# EasyEDA schematic SCH_esp32-8z_230302_2023-04-26.json
TITLE: Sheet_1; REV: 1.0; Date: 2022-12-07; Sheet: 1/1; Drawn By: tkdzhangyue; Company: Your Company
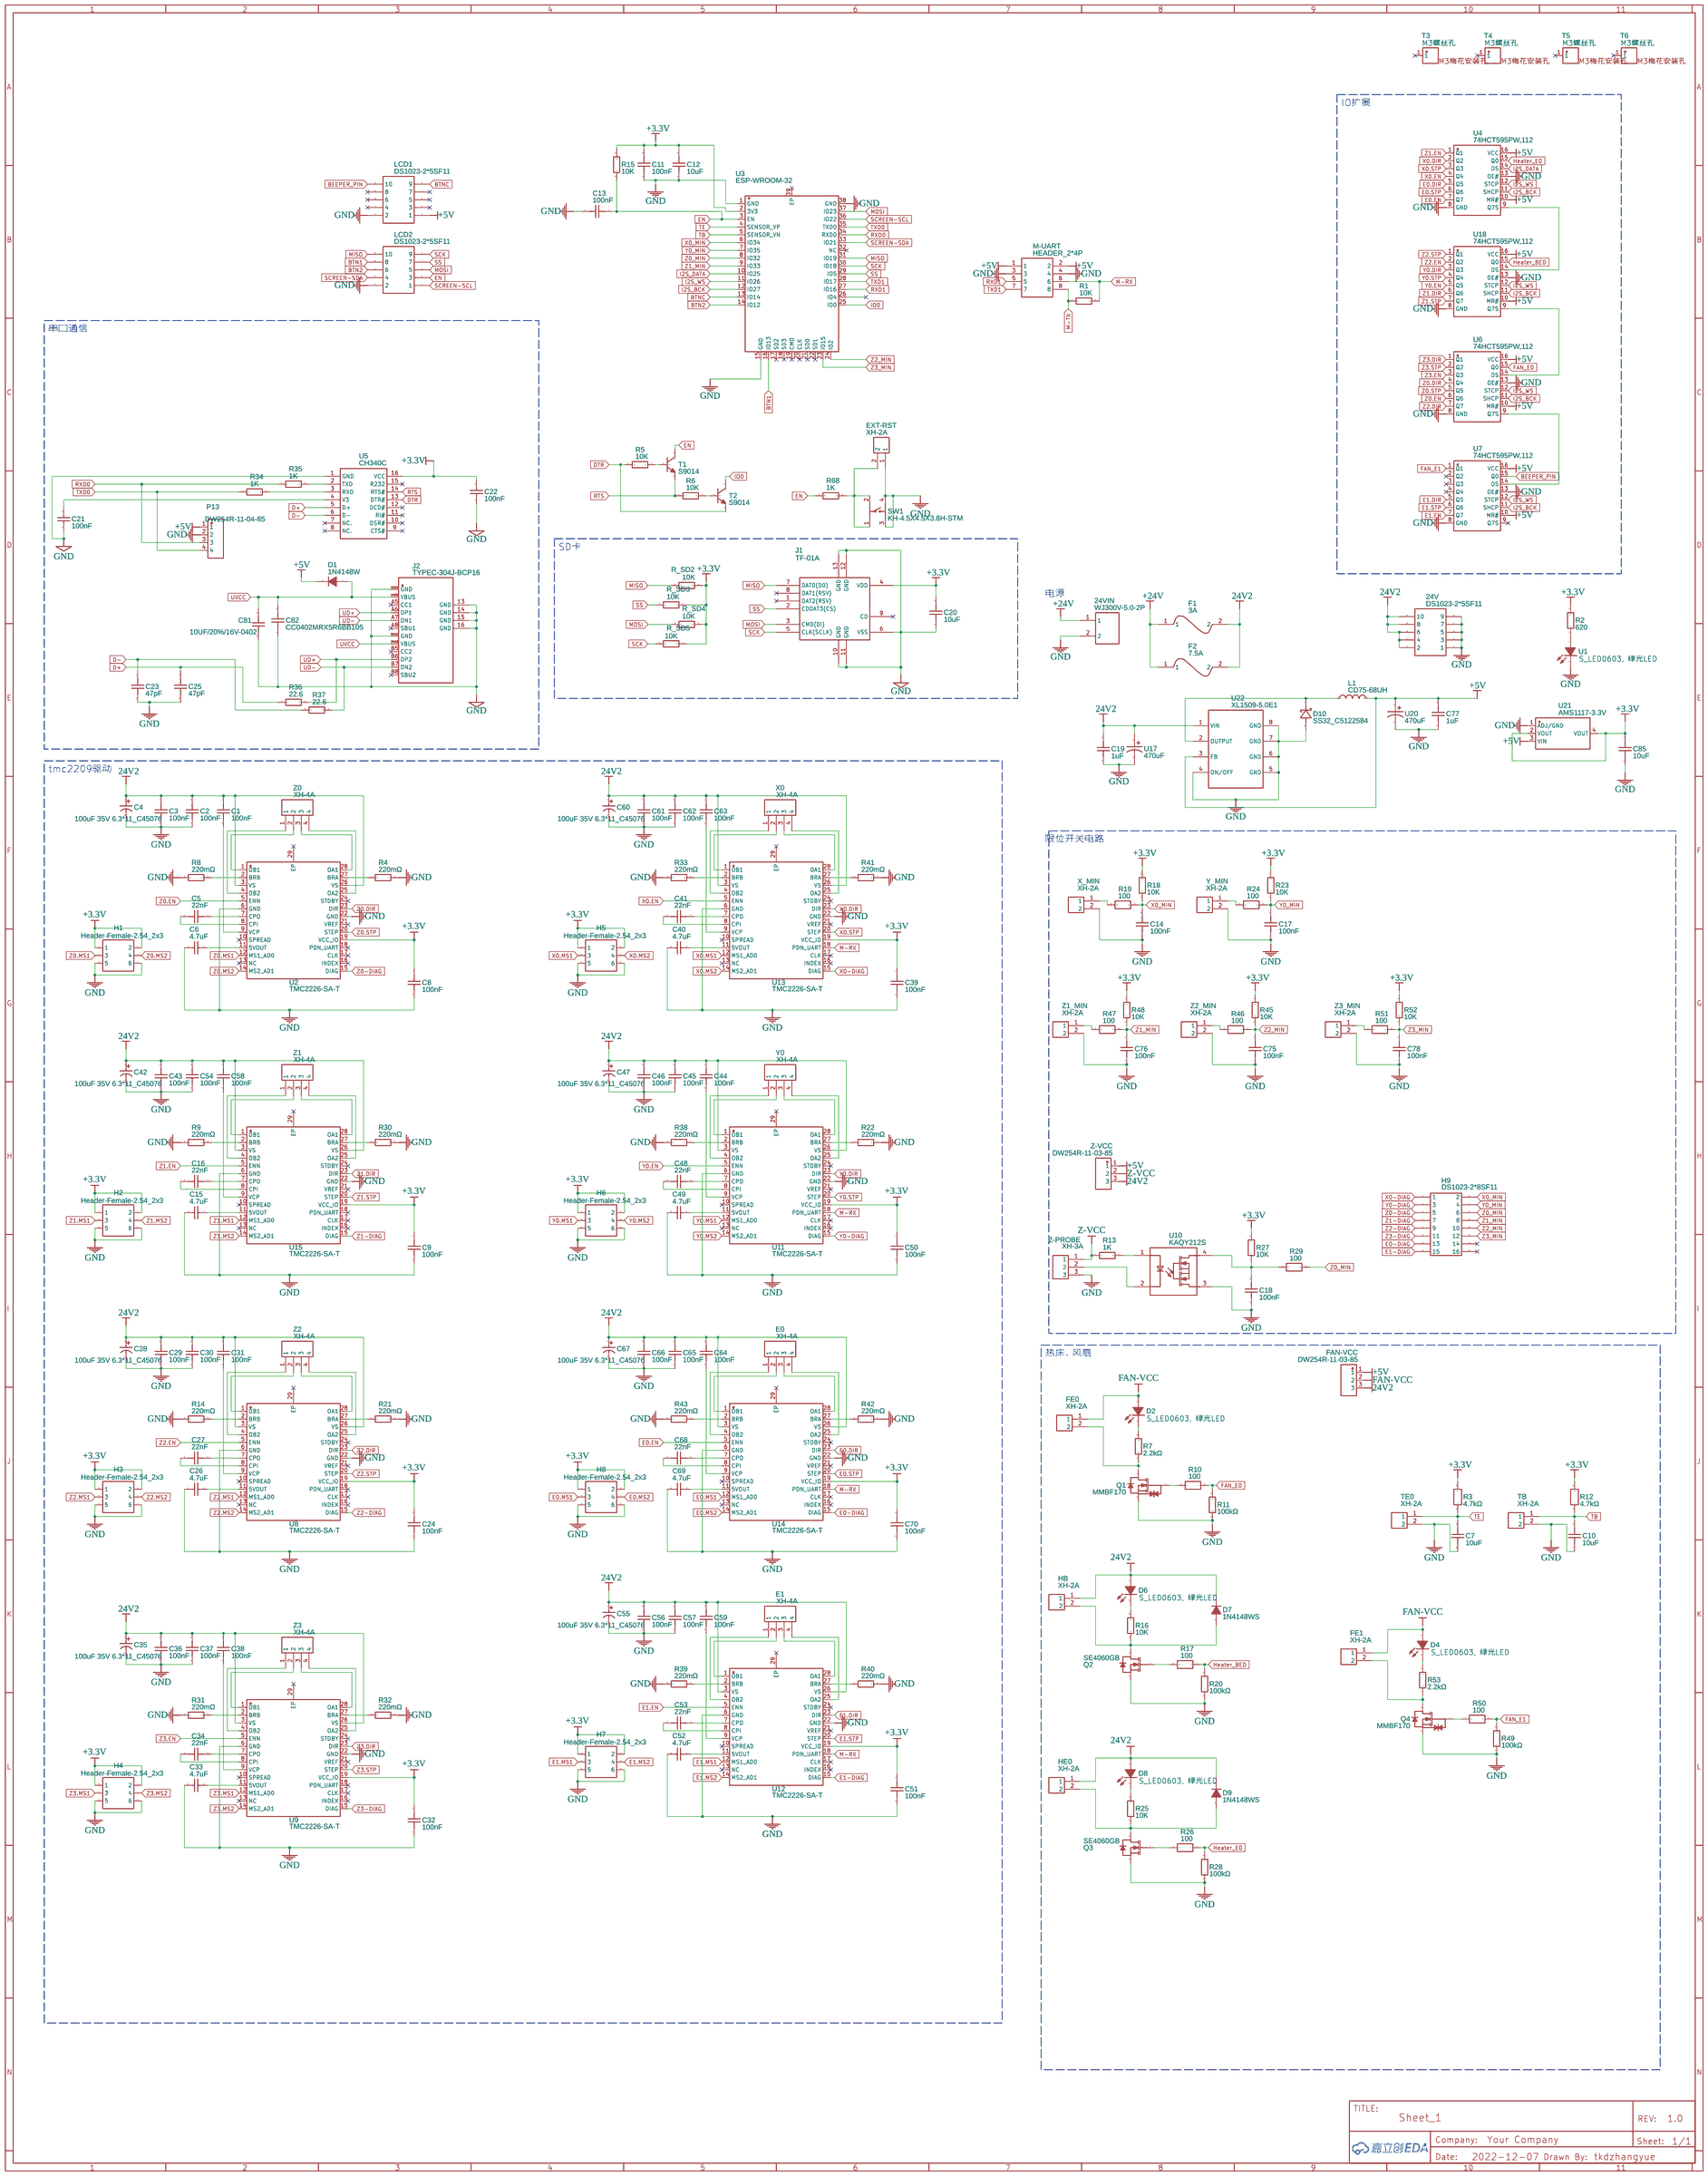
[diagram p0: schematic sheet]

## Parts
24V  DS1023-2*5SF11  [HDR-TH_10P-P2.54-V-F-R2-C5-S2.54]
24VIN  WJ300V-5.0-2P  [CONN-TH_2P-P5.00_WJ300V-5.00-2P]
C1  100nF  [C0603]
C2  100nF  [C0603]
C3  100nF  [C0603]
C4  100uF 35V 6.3*11_C45076  [CAP-TH_BD6.3-P2.50-D0.5-FD]
C5  22nF  [C0603]
C6  4.7uF  [C0603]
C7  10uF  [C0603]
C8  100nF  [C0603]
C9  100nF  [C0603]
C10  10uF  [C0603]
C11  100nF  [C0603]
C12  10uF  [C0603]
C13  100nF  [C0603]
C14  100nF  [C0603]
C15  4.7uF  [C0603]
C16  22nF  [C0603]
C17  100nF  [C0603]
C18  100nF  [C0603]
C19  1uF  [C0603]
C20  10uF  [C0603]
C21  100nF  [C0402]
C22  100nF  [C0402]
C23  47pF  [C0603]
C24  100nF  [C0603]
C25  47pF  [C0603]
C26  4.7uF  [C0603]
C27  22nF  [C0603]
C28  100uF 35V 6.3*11_C45076  [CAP-TH_BD6.3-P2.50-D0.5-FD]
C29  100nF  [C0603]
C30  100nF  [C0603]
C31  100nF  [C0603]
C32  100nF  [C0603]
C33  4.7uF  [C0603]
C34  22nF  [C0603]
C35  100uF 35V 6.3*11_C45076  [CAP-TH_BD6.3-P2.50-D0.5-FD]
C36  100nF  [C0603]
C37  100nF  [C0603]
C38  100nF  [C0603]
C39  100nF  [C0603]
C40  4.7uF  [C0603]
C41  22nF  [C0603]
C42  100uF 35V 6.3*11_C45076  [CAP-TH_BD6.3-P2.50-D0.5-FD]
C43  100nF  [C0603]
C44  100nF  [C0603]
C45  100nF  [C0603]
C46  100nF  [C0603]
C47  100uF 35V 6.3*11_C45076  [CAP-TH_BD6.3-P2.50-D0.5-FD]
C48  22nF  [C0603]
C49  4.7uF  [C0603]
C50  100nF  [C0603]
C51  100nF  [C0603]
C52  4.7uF  [C0603]
C53  22nF  [C0603]
C54  100nF  [C0603]
C55  100uF 35V 6.3*11_C45076  [CAP-TH_BD6.3-P2.50-D0.5-FD]
C56  100nF  [C0603]
C57  100nF  [C0603]
C58  100nF  [C0603]
C59  100nF  [C0603]
C60  100uF 35V 6.3*11_C45076  [CAP-TH_BD6.3-P2.50-D0.5-FD]
C61  100nF  [C0603]
C62  100nF  [C0603]
C63  100nF  [C0603]
C64  100nF  [C0603]
C65  100nF  [C0603]
C66  100nF  [C0603]
C67  100uF 35V 6.3*11_C45076  [CAP-TH_BD6.3-P2.50-D0.5-FD]
C68  22nF  [C0603]
C69  4.7uF  [C0603]
C70  100nF  [C0603]
C75  100nF  [C0603]
C76  100nF  [C0603]
C77  1uF  [C0603]
C78  100nF  [C0603]
C81  10UF/20%/16V-0402  [C0402]
C82  CC0402MRX5R6BB105  [C0402]
C85  10uF  [C0603]
D1  1N4148W  [SOD-123_L2.8-W1.8-LS3.7-RD]
D2  S_LED0603, 绿光LED  [LED0603-R-RD_GREEN]
D4  S_LED0603, 绿光LED  [LED0603-R-RD_GREEN]
D6  S_LED0603, 绿光LED  [LED0603-R-RD_GREEN]
D7  1N4148WS  [SOD-323_L1.8-W1.3-LS2.5-RD]
D8  S_LED0603, 绿光LED  [LED0603-R-RD_GREEN]
D9  1N4148WS  [SOD-323_L1.8-W1.3-LS2.5-RD]
D10  SS32_C5122584  [SMA_L4.3-W2.6-LS5.1-RD]
E0  XH-4A  [CONN-TH_4P-P2.50_XH-4A]
E1  XH-4A  [CONN-TH_4P-P2.50_XH-4A]
EXT-RST  XH-2A  [CONN-TH_XH-2A]
F1  3A  [小型汽车插片保险丝座]
F2  7.5A  [小型汽车插片保险丝座]
FAN-VCC  DW254R-11-03-85  [HDR-TH_3P-P2.54-V-F]
FE0  XH-2A  [CONN-TH_XH-2A]
FE1  XH-2A  [CONN-TH_XH-2A]
H1  Header-Female-2.54_2x3  [HDR-TH_6P-P2.54-V-F-R2-C3-S2.54]
H2  Header-Female-2.54_2x3  [HDR-TH_6P-P2.54-V-F-R2-C3-S2.54]
H3  Header-Female-2.54_2x3  [HDR-TH_6P-P2.54-V-F-R2-C3-S2.54]
H4  Header-Female-2.54_2x3  [HDR-TH_6P-P2.54-V-F-R2-C3-S2.54]
H5  Header-Female-2.54_2x3  [HDR-TH_6P-P2.54-V-F-R2-C3-S2.54]
H6  Header-Female-2.54_2x3  [HDR-TH_6P-P2.54-V-F-R2-C3-S2.54]
H7  Header-Female-2.54_2x3  [HDR-TH_6P-P2.54-V-F-R2-C3-S2.54]
H8  Header-Female-2.54_2x3  [HDR-TH_6P-P2.54-V-F-R2-C3-S2.54]
H9  DS1023-2*8SF11  [HDR-TH_16P-P2.54-V-F-R2-C8-S2.54]
HB  XH-2A  [CONN-TH_XH-2A]
HE0  XH-2A  [CONN-TH_XH-2A]
J1  TF-01A  [TF-SMD_TF-01A]
J2  TYPEC-304J-BCP16  [USB-C-SMD_TYPEC-304J-BCP16]
L1  CD75-68UH  [IND-SMD_L7.8-W7.0_APC07A50]
LCD1  DS1023-2*5SF11  [HDR-TH_10P-P2.54-V-F-R2-C5-S2.54]
LCD2  DS1023-2*5SF11  [HDR-TH_10P-P2.54-V-F-R2-C5-S2.54]
M-UART  HEADER_2*4P  [HDR-TH_8P-P2.54-V-M-R2-C4-S2.54]
P13  DW254R-11-04-85  [HDR-TH_4P-P2.54-V-F]
Q1  MMBF170  [SOT-23-3_L2.9-W1.6-P1.90-LS2.8-BR]
Q2  SE4060GB  [TO-252-2_L6.6-W6.1-P4.57-LS9.9-BR-CW]
Q3  SE4060GB  [TO-252-2_L6.6-W6.1-P4.57-LS9.9-BR-CW]
Q4  MMBF170  [SOT-23-3_L2.9-W1.6-P1.90-LS2.8-BR]
R1  10K  [R0603]
R2  620  [R0603]
R3  4.7kΩ  [R0603]
R4  220mΩ  [R0603]
R5  10K  [R0603]
R6  10K  [R0603]
R7  2.2kΩ  [R0603]
R8  220mΩ  [R0603]
R9  220mΩ  [R0603]
R10  100  [R0603]
R11  100kΩ  [R0603]
R12  4.7kΩ  [R0603]
R13  1K  [R0603]
R14  220mΩ  [R0603]
R15  10K  [R0603]
R16  10K  [R0603]
R17  100  [R0603]
R18  10K  [R0603]
R19  100  [R0603]
R20  100kΩ  [R0603]
R21  220mΩ  [R0603]
R22  220mΩ  [R0603]
R23  10K  [R0603]
R24  100  [R0603]
R25  10K  [R0603]
R26  100  [R0603]
R27  10K  [R0603]
R28  100kΩ  [R0603]
R29  100  [R0603]
R30  220mΩ  [R0603]
R31  220mΩ  [R0603]
R32  220mΩ  [R0603]
R33  220mΩ  [R0603]
R34  1K  [R0603]
R35  1K  [R0603]
R36  22.6  [R0603]
R37  22.6  [R0603]
R38  220mΩ  [R0603]
R39  220mΩ  [R0603]
R40  220mΩ  [R0603]
R41  220mΩ  [R0603]
R42  220mΩ  [R0603]
R43  220mΩ  [R0603]
R45  10K  [R0603]
R46  100  [R0603]
R47  100  [R0603]
R48  10K  [R0603]
R49  100kΩ  [R0603]
R50  100  [R0603]
R51  100  [R0603]
R52  10K  [R0603]
R53  2.2kΩ  [R0603]
R68  1K  [R0603]
R_SD2  10K  [R0603]
R_SD3  10K  [R0603]
R_SD4  10K  [R0603]
R_SD5  10K  [R0603]
SW1  KH-4.5X4.5X3.8H-STM  [SW-SMD_4P-L4.5-W4.5-P3.00-LS6.8]
T1  S9014  [SOT-23-3_L2.9-W1.6-P1.90-LS2.8-BR]
T2  S9014  [SOT-23-3_L2.9-W1.6-P1.90-LS2.8-BR]
T3  M3螺丝孔  [螺钉孔]
T4  M3螺丝孔  [螺钉孔]
T5  M3螺丝孔  [螺钉孔]
T6  M3螺丝孔  [螺钉孔]
TB  XH-2A  [CONN-TH_XH-2A]
TE0  XH-2A  [CONN-TH_XH-2A]
U1  S_LED0603, 绿光LED  [LED0603-R-RD_GREEN]
U2  TMC2226-SA-T  [HTSSOP-28_L9.8-W4.5-P0.65-LS6.6-BL-EP]
U3  ESP-WROOM-32  [WIFIM-SMD_ESP-WROOM-32]
U4  74HCT595PW,112  [TSSOP-16_L5.0-W4.4-P0.65-LS6.4-BL]
U5  CH340C  [SOP-16_L10.0-W3.9-P1.27-LS6.0-BL]
U6  74HCT595PW,112  [TSSOP-16_L5.0-W4.4-P0.65-LS6.4-BL]
U7  74HCT595PW,112  [TSSOP-16_L5.0-W4.4-P0.65-LS6.4-BL]
U8  TMC2226-SA-T  [HTSSOP-28_L9.8-W4.5-P0.65-LS6.6-BL-EP]
U9  TMC2226-SA-T  [HTSSOP-28_L9.8-W4.5-P0.65-LS6.6-BL-EP]
U10  KAQY212S  [SOP-4_L4.4-W4.0-P2.54-LS7.0-BL]
U11  TMC2226-SA-T  [HTSSOP-28_L9.8-W4.5-P0.65-LS6.6-BL-EP]
U12  TMC2226-SA-T  [HTSSOP-28_L9.8-W4.5-P0.65-LS6.6-BL-EP]
U13  TMC2226-SA-T  [HTSSOP-28_L9.8-W4.5-P0.65-LS6.6-BL-EP]
U14  TMC2226-SA-T  [HTSSOP-28_L9.8-W4.5-P0.65-LS6.6-BL-EP]
U15  TMC2226-SA-T  [HTSSOP-28_L9.8-W4.5-P0.65-LS6.6-BL-EP]
U17  470uF  [CAP-TH_BD8.0-P3.50-D0.5-FD]
U18  74HCT595PW,112  [TSSOP-16_L5.0-W4.4-P0.65-LS6.4-BL]
U20  470uF  [CAP-TH_BD8.0-P3.50-D0.5-FD]
U21  AMS1117-3.3V  [SOT-223-4_L6.5-W3.5-P2.30-LS7.0-BR]
U22  XL1509-5.0E1  [SOIC-8_L5.0-W4.0-P1.27-LS6.0-BL]
X0  XH-4A  [CONN-TH_4P-P2.50_XH-4A]
X_MIN  XH-2A  [CONN-TH_XH-2A]
Y0  XH-4A  [CONN-TH_4P-P2.50_XH-4A]
Y_MIN  XH-2A  [CONN-TH_XH-2A]
Z0  XH-4A  [CONN-TH_4P-P2.50_XH-4A]
Z1  XH-4A  [CONN-TH_4P-P2.50_XH-4A]
Z1_MIN  XH-2A  [CONN-TH_XH-2A]
Z2  XH-4A  [CONN-TH_4P-P2.50_XH-4A]
Z2_MIN  XH-2A  [CONN-TH_XH-2A]
Z3  XH-4A  [CONN-TH_4P-P2.50_XH-4A]
Z3_MIN  XH-2A  [CONN-TH_XH-2A]
Z-PROBE  XH-3A  [CONN-TH_XH-3A]
Z-VCC  DW254R-11-03-85  [HDR-TH_3P-P2.54-V-F]

## Library data of the parts
24V LCD1 LCD2 = DS1023-2*5SF11: Supplier: LCSC; Manufacturer: CONNFLY; Contributor: LCSC; Supplier Part: C92270; JLCPCB Part Class: Extended Part
24VIN = WJ300V-5.0-2P: Supplier: LCSC; Manufacturer: KANGNEX(康奈克斯电气); Supplier Part: C8385; JLCPCB Part Class: Extended Part
C1-C3 C8 C9 C11 C13 C14 C17 C18 C24 C29-C32 C36-C39 C43-C46 C50 C51 C54 C56-C59 C61-C66 C70 C75 C76 C78 = 06031C104KAT2A: Supplier: LCSC; Supplier Part: C2167300; Manufacturer: Kyocera AVX; JLCPCB Part Class: Extended Part; Contributor: LCSC
C4 C28 C35 C42 C47 C55 C60 C67 = 100uF 35V 6.3*11_C45076: Supplier Part: C45076; Supplier: LCSC; Manufacturer: ValuePro; Manufacturer Part: 100uF 35V 6.3*11; JLCPCB Part Class: Extended Part
C5 C16 C27 C34 C41 C48 C53 C68 = CC0603JRX7R7BB223: Supplier: LCSC; Supplier Part: C519532; Manufacturer: YAGEO(国巨); Contributor: LCSC; JLCPCB Part Class: Extended Part
C6 C15 C26 C33 C40 C49 C52 C69 = CC0603KRX5R6BB475: Supplier: LCSC; Manufacturer: YAGEO(国巨); Supplier Part: C109456; JLCPCB Part Class: Extended Part
C7 C10 = 10UF: Supplier: LCSC; Supplier Part: C15415; Manufacturer: SAMSUNG(三星); Contributor: LCSC; JLCPCB Part Class: Extended Part
C12 C20 C85 = TCC0603X5R106K100CT: Supplier: LCSC; Supplier Part: C380314; Manufacturer: CCTC(三环); Contributor: LCSC; JLCPCB Part Class: Extended Part
C19 C77 = 0603B105K500NT: Supplier: LCSC; Manufacturer: FH(风华); Supplier Part: C90540; JLCPCB Part Class: Extended Part
C21 C22 = 0402YD104KAT2A: Supplier: LCSC; Manufacturer: AVX; Contributor: LCSC; Supplier Part: C142647
C23 C25 = 0603N470F101: Supplier: LCSC; Manufacturer: Walsin(华新科); Contributor: LCSC; Supplier Part: C152905; JLCPCB Part Class: Extended Part
C81 = 10UF/20%/16V-0402: Supplier: LCSC; Supplier Part: C9900005775; Manufacturer Part: 10uF/20%/16V-0402; JLCPCB Part Class: Extended Part; Contributor: LCSC
C82 = CC0402MRX5R6BB105: Supplier: LCSC; Supplier Part: C113791; Manufacturer: YAGEO(国巨); Capacitance: 1uF; JLCPCB Part Class: Extended Part; Contributor: LCSC
D1 = 1N4148W: Supplier: LCSC; Manufacturer: HT; Contributor: LCSC; Supplier Part: C179717; JLCPCB Part Class: Extended Part
D2 D4 D6 D8 U1 = S_LED0603, 绿光LED: Supplier: LCSC; Supplier Part: C9900025458; Manufacturer: null; link: https://atta.szlcsc.comnull; JLCPCB Part Class: Extended Part; Contributor: lcsc
D7 D9 = 1N4148WS: Supplier: LCSC; Manufacturer: HT(金誉); Contributor: LCSC; Supplier Part: C179718; JLCPCB Part Class: Extended Part
D10 = SS32_C5122584: Supplier: LCSC; Supplier Part: C5122584; Manufacturer: Slkor(萨科微); Manufacturer Part: SS32; JLCPCB Part Class: Extended Part; Contributor: lcsc
E0 E1 X0 Y0 Z0-Z3 = XH-4A: Supplier: LCSC; Manufacturer: BOOMELE; Supplier Part: C37815; JLCPCB Part Class: Extended Part
EXT-RST FE0 FE1 HB HE0 TB TE0 X_MIN Y_MIN Z1_MIN Z2_MIN Z3_MIN = XH-2A: Supplier: LCSC; Manufacturer: BOOMELE; Supplier Part: C20079; JLCPCB Part Class: Extended Part
F1 F2 = 小型汽车插片保险座: Contributor: tkdzhangyue
FAN-VCC Z-VCC = DW254R-11-03-85: Supplier: LCSC; Supplier Part: C2935897; Manufacturer: DEALON(德艺隆); Contributor: LCSC; JLCPCB Part Class: Extended Part
H1-H8 = Header-Female-2.54_2x3: Supplier: LCSC; Manufacturer: CONNFLY; Manufacturer Part: DS1023-2*3SF11; Contributor: LCSC; Supplier Part: C92272; JLCPCB Part Class: Extended Part
H9 = DS1023-2*8SF11: Supplier: LCSC; Manufacturer: CONNFLY; Contributor: LCSC; Supplier Part: C92267; JLCPCB Part Class: Extended Part
J1 = TF-01A: Supplier: LCSC; Manufacturer: HRO; Supplier Part: C91145; JLCPCB Part Class: Extended Part
J2 = TYPEC-304J-BCP16: Supplier: LCSC; Supplier Part: C2835315; Manufacturer: XUNPU(讯普); Contributor: LCSC; JLCPCB Part Class: Extended Part
L1 = CD75-68UH: Supplier: LCSC; Supplier Part: C2836693; Manufacturer: null; Contributor: LCSC; JLCPCB Part Class: Extended Part
M-UART = HEADER_2*4P: Supplier: LCSC; Supplier Part: C9900003187; Manufacturer: null; JLCPCB Part Class: Extended Part; Contributor: LCSC
P13 = DW254R-11-04-85: Supplier: LCSC; Supplier Part: C2935898; Manufacturer: DEALON(德艺隆); Contributor: LCSC; JLCPCB Part Class: Extended Part
Q1 Q4 = MMBF170: Supplier: LCSC; Manufacturer: SHIKUES(时科); Supplier Part: C130879; JLCPCB Part Class: Extended Part
Q2 Q3 = SE4060GB: Supplier: LCSC; Supplier Part: C238624; Manufacturer: SINO-IC(光宇睿芯); Contributor: LCSC; JLCPCB Part Class: Extended Part
R1 R5 R6 R15 R16 R18 R23 R25 R27 R45 R48 R52 R_SD2-R_SD5 = AF0603JR-0710KL: Supplier: LCSC; Manufacturer: YAGEO(国巨); Supplier Part: C144116; JLCPCB Part Class: Extended Part; Resistance: 10kΩ
R2 = RC0603JR-07620RL: Supplier: LCSC; Manufacturer: YAGEO(国巨); Supplier Part: C137616; JLCPCB Part Class: Extended Part; Resistance: 620Ω
R3 R12 = RT0603FRE074K7L: Supplier: LCSC; Supplier Part: C700513; Manufacturer: YAGEO(国巨); Contributor: LCSC; JLCPCB Part Class: Extended Part
R4 R8 R9 R14 R21 R22 R30-R33 R38-R43 = CR0603F0R22P05: Supplier: LCSC; Supplier Part: C175648; Manufacturer: EVER OHMS(天二科技); Manufacturer Part: CR0603FR220P05Z; Resistance (Ohms): 0.22; Contributor: LCSC; JLCPCB Part Class: Extended Part
R7 R53 = RMC06032.2K1%N: Supplier: LCSC; Supplier Part: C325591; Manufacturer: Tyohm(幸亚电阻); Resistance (Ohms): 2.2K; Contributor: LCSC; JLCPCB Part Class: Extended Part
R10 R17 R19 R24 R26 R29 R46 R47 R50 R51 = AC0603DR-07100RL: Supplier: LCSC; Supplier Part: C227435; Manufacturer: YAGEO(国巨); Contributor: LCSC; JLCPCB Part Class: Extended Part; Resistance: 100Ω
R11 R20 R28 R49 = RMCF0603FT100K: Supplier: LCSC; Supplier Part: C237792; Manufacturer: SEI(Stackpole Electronics Inc.); Resistance (Ohms): 100K; Contributor: LCSC; JLCPCB Part Class: Extended Part
R13 R68 = RT0603FRD071KL: Supplier: LCSC; Manufacturer: YAGEO(国巨); Contributor: LCSC; Supplier Part: C136938; JLCPCB Part Class: Extended Part; Resistance: 1kΩ
R34 R35 = RC0603JR-071KL: Supplier: LCSC; Manufacturer: YAGEO(国巨); Supplier Part: C14676; JLCPCB Part Class: Extended Part; Resistance: 1kΩ
R36 R37 = AC0603FR-0722R6L: Supplier: LCSC; Supplier Part: C227718; Manufacturer: YAGEO(国巨); Contributor: LCSC; JLCPCB Part Class: Extended Part; Resistance: 22.6Ω
SW1 = KH-4.5X4.5X3.8H-STM: Supplier: LCSC; Supplier Part: C2837549; Manufacturer: kinghelm(金航标); Contributor: LCSC; JLCPCB Part Class: Extended Part
T1 T2 = S9014: Supplier: LCSC; Manufacturer: Hottech(合科泰); Contributor: LCSC; Supplier Part: C181164; JLCPCB Part Class: Extended Part
T3-T6 = M3螺丝孔: Contributor: wowlkh
U2 U8 U9 U11-U15 = TMC2226-SA-T: Supplier: LCSC; Supplier Part: C705366; Manufacturer: TRINAMIC; Contributor: LCSC; JLCPCB Part Class: Extended Part
U3 = ESP-WROOM-32: Supplier: LCSC; Manufacturer: ESPRESSIF; Supplier Part: C95209; JLCPCB Part Class: Extended Part
U4 U6 U7 U18 = 74HCT595PW,112: Supplier: LCSC; Supplier Part: C547810; Manufacturer: Nexperia(安世); Contributor: LCSC; JLCPCB Part Class: Extended Part
U5 = CH340C: Supplier: LCSC; Manufacturer: WCH; Supplier Part: C84681; JLCPCB Part Class: Extended Part
U10 = KAQY212S: Supplier: LCSC; Supplier Part: C194898; Manufacturer: Cosmo Electronics; Contributor: LCSC; JLCPCB Part Class: Extended Part
U17 U20 = 25V470UF CD110: Supplier: LCSC; Supplier Part: C2960234; Manufacturer: HRK(鸿瑞凯电子); Manufacturer Part: 25V470uF CD110; link: https://atta.szlcsc.com/upload/public/pdf/source/20220224/123D914837BFA78A3349BA812F212800.pdf; Contributor: lcsc
U21 = AMS1117-3.3V: Supplier: LCSC; Supplier Part: C2688239; Manufacturer: WPMtek(维攀微); Contributor: LCSC; JLCPCB Part Class: Extended Part
U22 = XL1509-5.0E1: Supplier: LCSC; Manufacturer: XLSEMI(芯龙); Supplier Part: C61063; JLCPCB Part Class: Basic Part
Z-PROBE = XH-3A: Supplier: LCSC; Manufacturer: BOOMELE(博穆精密); Supplier Part: C2316; JLCPCB Part Class: Extended Part

## Nets
24V2: 24V.2 24V.4 24V.6 24V.8 24V.10 C1.1 C2.2 C3.2 C4.1 C19.2 C28.1 C29.2 C30.2 C31.1 C35.1 C36.2 C37.2 C38.1 C42.1 C43.2 C44.1 C45.2 C46.2 C47.1 C54.2 C55.1 C56.2 C57.2 C58.1 C59.1 C60.1 C61.2 C62.2 C63.1 C64.1 C65.2 C66.2 C67.1 D6.1(+) D7.1(K) D8.1(+) D9.1(K) F1.2 F2.2 FAN-VCC.3 HB.1 HE0.1 U2.3(VS) U2.26(VS) U8.3(VS) U8.26(VS) U9.3(VS) U9.26(VS) U11.3(VS) U11.26(VS) U12.3(VS) U12.26(VS) U13.3(VS) U13.26(VS) U14.3(VS) U14.26(VS) U15.3(VS) U15.26(VS) U17.1 U22.1(VIN) Z-VCC.3
+3.3V: C8.1 C9.1 C11.2 C12.2 C20.2 C22.2 C24.1 C32.1 C39.1 C50.1 C51.1 C70.1 C85.2 H1.1 H1.2 H2.1 H2.2 H3.1 H3.2 H4.1 H4.2 H5.1 H5.2 H6.1 H6.2 H7.1 H7.2 H8.1 H8.2 J1.4(VDD) R2.2 R3.2 R12.2 R15.2 R18.1 R23.1 R27.2 R45.1 R48.1 R52.1 R_SD2.1 R_SD3.1 R_SD4.1 R_SD5.1 U2.19(VCC_IO) U3.2(3V3) U5.16(VCC) U8.19(VCC_IO) U9.19(VCC_IO) U11.19(VCC_IO) U12.19(VCC_IO) U13.19(VCC_IO) U14.19(VCC_IO) U15.19(VCC_IO) U21.2(VOUT) U21.4(VOUT)
+5V: C77.2 D1.1(K) FAN-VCC.1 L1.2 LCD1.1 M-UART.1 M-UART.2 P13.1 U4.10(MR#) U4.16(VCC) U6.10(MR#) U6.16(VCC) U7.10(MR#) U7.16(VCC) U18.10(MR#) U18.16(VCC) U20.1 U21.3(VIN) U22.3(FB) Z-VCC.1
+24V: 24VIN.1 F1.1 F2.1
GND: 24V.1 24V.3 24V.5 24V.7 24V.9 24VIN.2 C2.1 C3.1 C4.2 C6.2 C7.1 C8.2 C9.2 C10.1 C11.1 C12.1 C13.2 C14.1 C15.2 C17.1 C18.1 C19.1 C20.1 C21.1 C22.1 C23.2 C24.2 C25.2 C26.2 C28.2 C29.1 C30.1 C32.2 C33.2 C35.2 C36.1 C37.1 C39.2 C40.2 C42.2 C43.1 C45.1 C46.1 C47.2 C49.2 C50.2 C51.2 C52.2 C54.1 C55.2 C56.1 C57.1 C60.2 C61.1 C62.1 C65.1 C66.1 C67.2 C69.2 C70.2 C75.1 C76.1 C77.1 C78.1 C81.2 C82.2 C85.1 D10.2 EXT-RST.1 H1.5 H1.6 H2.5 H2.6 H3.5 H3.6 H4.5 H4.6 H5.5 H5.6 H6.5 H6.6 H7.5 H7.6 H8.5 H8.6 J1.6(VSS) J1.10(GND) J1.11(GND) J1.12(GND) J1.13(GND) J2.13(GND) J2.14(GND) J2.15(GND) J2.16(GND) J2.A1B12(GND) J2.B1A12(GND) LCD1.2 LCD2.2 M-UART.3 M-UART.4 P13.2 Q1.2(S) Q2.3(S) Q3.3(S) Q4.2(S) R4.1 R8.2 R9.2 R11.1 R14.2 R20.1 R21.1 R22.1 R28.1 R30.1 R31.2 R32.1 R33.2 R38.2 R39.2 R40.1 R41.1 R42.1 R43.2 R49.1 SW1.3 SW1.4 TB.2 TE0.2 U1.2(-) U2.6(GND) U2.22(GND) U3.1(GND) U3.15(GND) U3.38(GND) U4.8(GND) U4.13(OE#) U5.1(GND) U6.8(GND) U6.13(OE#) U7.8(GND) U7.13(OE#) U8.6(GND) U8.22(GND) U9.6(GND) U9.22(GND) U10.3 U11.6(GND) U11.22(GND) U12.6(GND) U12.22(GND) U13.6(GND) U13.22(GND) U14.6(GND) U14.22(GND) U15.6(GND) U15.22(GND) U17.2 U18.8(GND) U18.13(OE#) U20.2 U21.1(ADJ/GND) U22.4(ON/OFF) U22.5(GND) U22.6(GND) U22.7(GND) U22.8(GND) X_MIN.2 Y_MIN.2 Z1_MIN.2 Z2_MIN.2 Z3_MIN.2 Z-PROBE.3
BEEPER_PIN: LCD1.10 U7.15(Q0)
BTN1: LCD2.8 U3.16(IO13)
BTN2: LCD2.6 U3.14(IO12)
BTNC: LCD1.9 U3.13(IO14)
D+: C25.1 R36.1 U5.5(D+)
D-: C23.1 R37.1 U5.6(D-)
DTR: R5.2 T2.2(E) U5.13(DTR#)
E0-DIAG: H9.13 U14.15(DIAG)
E0.DIR: U4.5(Q5) U14.23(DIR)
E0.EN: U4.7(Q7) U14.5(ENN)
E0.MS1: H8.3 U14.12(MS1_AD0)
E0.MS2: H8.4 U14.14(MS2_AD1)
E0.STP: U4.6(Q6) U14.20(STEP)
E1-DIAG: H9.15 U12.15(DIAG)
E1.DIR: U7.5(Q5) U12.23(DIR)
E1.EN: U7.7(Q7) U12.5(ENN)
E1.MS1: H7.3 U12.12(MS1_AD0)
E1.MS2: H7.4 U12.14(MS2_AD1)
E1.STP: U7.6(Q6) U12.20(STEP)
EN: C13.1 LCD2.3 R15.1 R68.1 T1.3(C) U3.3(EN)
FAN-VCC: D2.1(+) D4.1(+) FAN-VCC.2 FE0.1 FE1.1
FAN_E0: R10.1 R11.2 U6.15(Q0)
FAN_E1: R49.2 R50.1 U7.1(Q1)
Heater_BED: R17.1 R20.2 U18.15(Q0)
Heater_E0: R26.1 R28.2 U4.15(Q0)
I2S_BCK: U3.12(IO27) U4.11(SHCP) U6.11(SHCP) U7.11(SHCP) U18.11(SHCP)
I2S_DATA: U3.10(IO25) U4.14(DS)
I2S_WS: U3.11(IO26) U4.12(STCP) U6.12(STCP) U7.12(STCP) U18.12(STCP)
IO0: T2.3(C) U3.25(IO0)
M-RX: M-UART.6 R1.1 U11.18(PDN_UART) U12.18(PDN_UART) U13.18(PDN_UART) U14.18(PDN_UART)
M-TX: M-UART.8 R1.2
MISO: J1.7(DAT0(D0)) LCD2.10 R_SD2.2 U3.31(IO19)
MOSI: J1.3(CMD(DI)) LCD2.5 R_SD4.2 U3.37(IO23)
RTS: R6.2 T1.2(E) U5.14(RTS#)
RXD0: P13.3 R35.1 U3.34(RXD0)
RXD1: M-UART.5 U3.27(IO16)
SCK: J1.5(CLK(SCLK)) LCD2.9 R_SD5.2 U3.30(IO18)
SCREEN-SCL: LCD2.1 U3.36(IO22)
SCREEN-SDA: LCD2.4 U3.33(IO21)
SS: J1.2(CDDAT3(CS)) LCD2.7 R_SD3.2 U3.29(IO5)
TB: C10.2 R12.1 TB.1 U3.5(SENSOR_VN)
TE: C7.2 R3.1 TE0.1 U3.4(SENSOR_VP)
TXD0: P13.4 R34.1 U3.35(TXD0)
TXD1: M-UART.7 U3.28(IO17)
UD+: J2.A6(DP1) J2.B6(DP2) R36.2
UD-: J2.A7(DN1) J2.B7(DN2) R37.2
UVCC: C81.1 C82.1 D1.2(A) J2.A4B9(VBUS) J2.B4A9(VBUS)
X0-DIAG: H9.1 U13.15(DIAG)
X0.DIR: U4.2(Q2) U13.23(DIR)
X0.EN: U4.4(Q4) U13.5(ENN)
X0.MS1: H5.3 U13.12(MS1_AD0)
X0.MS2: H5.4 U13.14(MS2_AD1)
X0.STP: U4.3(Q3) U13.20(STEP)
X0_MIN: C14.2 H9.2 R18.2 R19.1 U3.6(IO34)
Y0-DIAG: H9.3 U11.15(DIAG)
Y0.DIR: U11.23(DIR) U18.3(Q3)
Y0.EN: U11.5(ENN) U18.5(Q5)
Y0.MS1: H6.3 U11.12(MS1_AD0)
Y0.MS2: H6.4 U11.14(MS2_AD1)
Y0.STP: U11.20(STEP) U18.4(Q4)
Y0_MIN: C17.2 H9.4 R23.2 R24.1 U3.7(IO35)
Z0-DIAG: H9.5 U2.15(DIAG)
Z0.DIR: U2.23(DIR) U6.4(Q4)
Z0.EN: U2.5(ENN) U6.6(Q6)
Z0.MS1: H1.3 U2.12(MS1_AD0)
Z0.MS2: H1.4 U2.14(MS2_AD1)
Z0.STP: U2.20(STEP) U6.5(Q5)
Z0_MIN: H9.6 R29.1 U3.8(IO32)
Z1-DIAG: H9.7 U15.15(DIAG)
Z1.DIR: U15.23(DIR) U18.6(Q6)
Z1.EN: U4.1(Q1) U15.5(ENN)
Z1.MS1: H2.3 U15.12(MS1_AD0)
Z1.MS2: H2.4 U15.14(MS2_AD1)
Z1.STP: U15.20(STEP) U18.7(Q7)
Z1_MIN: C76.2 H9.8 R47.1 R48.2 U3.9(IO33)
Z2-DIAG: H9.9 U8.15(DIAG)
Z2.DIR: U6.7(Q7) U8.23(DIR)
Z2.EN: U8.5(ENN) U18.2(Q2)
Z2.MS1: H3.3 U8.12(MS1_AD0)
Z2.MS2: H3.4 U8.14(MS2_AD1)
Z2.STP: U8.20(STEP) U18.1(Q1)
Z2_MIN: C75.2 H9.10 R45.2 R46.1 U3.24(IO2)
Z3-DIAG: H9.11 U9.15(DIAG)
Z3.DIR: U6.1(Q1) U9.23(DIR)
Z3.EN: U6.3(Q3) U9.5(ENN)
Z3.MS1: H4.3 U9.12(MS1_AD0)
Z3.MS2: H4.4 U9.14(MS2_AD1)
Z3.STP: U6.2(Q2) U9.20(STEP)
Z3_MIN: C78.2 H9.12 R51.1 R52.2 U3.23(IO15)
Z-VCC: R13.1 Z-PROBE.1 Z-VCC.2
Net-(C1-2): C1.2 U2.9(VCP)
Net-(C5-1): C5.1 U2.7(CPO)
Net-(C5-2): C5.2 U2.8(CPI)
Net-(C6-1): C6.1 U2.11(5VOUT)
Net-(C15-1): C15.1 U15.11(5VOUT)
Net-(C16-1): C16.1 U15.7(CPO)
Net-(C16-2): C16.2 U15.8(CPI)
Net-(C18-2): C18.2 R27.1 R29.2 U10.4
Net-(C21-2): C21.2 U5.4(V3)
Net-(C26-1): C26.1 U8.11(5VOUT)
Net-(C27-1): C27.1 U8.7(CPO)
Net-(C27-2): C27.2 U8.8(CPI)
Net-(C31-2): C31.2 U8.9(VCP)
Net-(C33-1): C33.1 U9.11(5VOUT)
Net-(C34-1): C34.1 U9.7(CPO)
Net-(C34-2): C34.2 U9.8(CPI)
Net-(C38-2): C38.2 U9.9(VCP)
Net-(C40-1): C40.1 U13.11(5VOUT)
Net-(C41-1): C41.1 U13.7(CPO)
Net-(C41-2): C41.2 U13.8(CPI)
Net-(C44-2): C44.2 U11.9(VCP)
Net-(C48-1): C48.1 U11.7(CPO)
Net-(C48-2): C48.2 U11.8(CPI)
Net-(C49-1): C49.1 U11.11(5VOUT)
Net-(C52-1): C52.1 U12.11(5VOUT)
Net-(C53-1): C53.1 U12.7(CPO)
Net-(C53-2): C53.2 U12.8(CPI)
Net-(C58-2): C58.2 U15.9(VCP)
Net-(C59-2): C59.2 U12.9(VCP)
Net-(C63-2): C63.2 U13.9(VCP)
Net-(C64-2): C64.2 U14.9(VCP)
Net-(C68-1): C68.1 U14.7(CPO)
Net-(C68-2): C68.2 U14.8(CPI)
Net-(C69-1): C69.1 U14.11(5VOUT)
Net-(D2-2): D2.2(-) R7.2
Net-(D4-2): D4.2(-) R53.2
Net-(D6-2): D6.2(-) R16.2
Net-(D7-2): D7.2(A) HB.2 Q2.2(D) R16.1
Net-(D8-2): D8.2(-) R25.2
Net-(D9-2): D9.2(A) HE0.2 Q3.2(D) R25.1
Net-(D10-1): D10.1 L1.1 U22.2(OUTPUT)
Net-(E0-1): E0.1 U14.4(OB2)
Net-(E0-2): E0.2 U14.1(OB1)
Net-(E0-3): E0.3 U14.28(OA1)
Net-(E0-4): E0.4 U14.25(OA2)
Net-(E1-1): E1.1 U12.4(OB2)
Net-(E1-2): E1.2 U12.1(OB1)
Net-(E1-3): E1.3 U12.28(OA1)
Net-(E1-4): E1.4 U12.25(OA2)
Net-(EXT-RST-2): EXT-RST.2 R68.2 SW1.1 SW1.2
Net-(FE0-2): FE0.2 Q1.3(D) R7.1
Net-(FE1-2): FE1.2 Q4.3(D) R53.1
Net-(Q1-1): Q1.1(G) R10.2
Net-(Q2-1): Q2.1(G) R17.2
Net-(Q3-1): Q3.1(G) R26.2
Net-(Q4-1): Q4.1(G) R50.2
Net-(R2-1): R2.1 U1.1(+)
Net-(R4-2): R4.2 U2.27(BRA)
Net-(R5-1): R5.1 T1.1(B)
Net-(R6-1): R6.1 T2.1(B)
Net-(R8-1): R8.1 U2.2(BRB)
Net-(R9-1): R9.1 U15.2(BRB)
Net-(R13-2): R13.2 U10.1
Net-(R14-1): R14.1 U8.2(BRB)
Net-(R19-2): R19.2 X_MIN.1
Net-(R21-2): R21.2 U8.27(BRA)
Net-(R22-2): R22.2 U11.27(BRA)
Net-(R24-2): R24.2 Y_MIN.1
Net-(R30-2): R30.2 U15.27(BRA)
Net-(R31-1): R31.1 U9.2(BRB)
Net-(R32-2): R32.2 U9.27(BRA)
Net-(R33-1): R33.1 U13.2(BRB)
Net-(R34-2): R34.2 U5.3(RXD)
Net-(R35-2): R35.2 U5.2(TXD)
Net-(R38-1): R38.1 U11.2(BRB)
Net-(R39-1): R39.1 U12.2(BRB)
Net-(R40-2): R40.2 U12.27(BRA)
Net-(R41-2): R41.2 U13.27(BRA)
Net-(R42-2): R42.2 U14.27(BRA)
Net-(R43-1): R43.1 U14.2(BRB)
Net-(R46-2): R46.2 Z2_MIN.1
Net-(R47-2): R47.2 Z1_MIN.1
Net-(R51-2): R51.2 Z3_MIN.1
Net-(U2-1): U2.1(OB1) Z0.2
Net-(U2-4): U2.4(OB2) Z0.1
Net-(U2-25): U2.25(OA2) Z0.4
Net-(U2-28): U2.28(OA1) Z0.3
Net-(U4-9): U4.9(Q7S) U18.14(DS)
Net-(U6-9): U6.9(Q7S) U7.14(DS)
Net-(U6-14): U6.14(DS) U18.9(Q7S)
Net-(U8-1): U8.1(OB1) Z2.2
Net-(U8-4): U8.4(OB2) Z2.1
Net-(U8-25): U8.25(OA2) Z2.4
Net-(U8-28): U8.28(OA1) Z2.3
Net-(U9-1): U9.1(OB1) Z3.2
Net-(U9-4): U9.4(OB2) Z3.1
Net-(U9-25): U9.25(OA2) Z3.4
Net-(U9-28): U9.28(OA1) Z3.3
Net-(U10-2): U10.2 Z-PROBE.2
Net-(U11-1): U11.1(OB1) Y0.2
Net-(U11-4): U11.4(OB2) Y0.1
Net-(U11-25): U11.25(OA2) Y0.4
Net-(U11-28): U11.28(OA1) Y0.3
Net-(U13-1): U13.1(OB1) X0.2
Net-(U13-4): U13.4(OB2) X0.1
Net-(U13-25): U13.25(OA2) X0.4
Net-(U13-28): U13.28(OA1) X0.3
Net-(U15-1): U15.1(OB1) Z1.2
Net-(U15-4): U15.4(OB2) Z1.1
Net-(U15-25): U15.25(OA2) Z1.4
Net-(U15-28): U15.28(OA1) Z1.3

Not connected (* = marked no-connect by the designer): H9 14* 16*; J1 1(DAT2(RSV))* 8(DAT1(RSV))* 9(CD)*; J2 A5(CC1)* A8(SBU1)* B5(CC2)* B8(SBU2)*; LCD1 3* 4* 5* 6* 7* 8*; T3 1*; T4 1*; T5 1*; T6 1*; U2 10(SPREAD)* 13(NC)* 16(INDEX)* 17(CLK)* 18(PDN_UART)* 21(VREF)* 24(STDBY)* 29(EP)*; U3 17(SD2)* 18(SD3)* 19(CMD)* 20(CLK)* 21(SD0)* 22(SD1)* 26(IO4) 32(NC)* 39(EP)*; U5 7(NC.)* 8(NC.)* 9(CTS#)* 10(DSR#)* 11(RI#)* 12(DCD#)* 15(R232)*; U7 2(Q2)* 3(Q3)* 4(Q4)* 9(Q7S)*; U8 10(SPREAD)* 13(NC)* 16(INDEX)* 17(CLK)* 18(PDN_UART)* 21(VREF)* 24(STDBY)* 29(EP)*; U9 10(SPREAD)* 13(NC)* 16(INDEX)* 17(CLK)* 18(PDN_UART)* 21(VREF)* 24(STDBY)* 29(EP)*; U11 10(SPREAD)* 13(NC)* 16(INDEX)* 17(CLK)* 21(VREF)* 24(STDBY)* 29(EP)*; U12 10(SPREAD)* 13(NC)* 16(INDEX)* 17(CLK)* 21(VREF)* 24(STDBY)* 29(EP)*; U13 10(SPREAD)* 13(NC)* 16(INDEX)* 17(CLK)* 21(VREF)* 24(STDBY)* 29(EP)*; U14 10(SPREAD)* 13(NC)* 16(INDEX)* 17(CLK)* 21(VREF)* 24(STDBY)* 29(EP)*; U15 10(SPREAD)* 13(NC)* 16(INDEX)* 17(CLK)* 18(PDN_UART)* 21(VREF)* 24(STDBY)* 29(EP)*

## Notes on the sheet
- IO扩展
- 串口通信
- SD卡
- 电源
- tmc2209驱动
- 限位开关电路
- 热床、风扇
